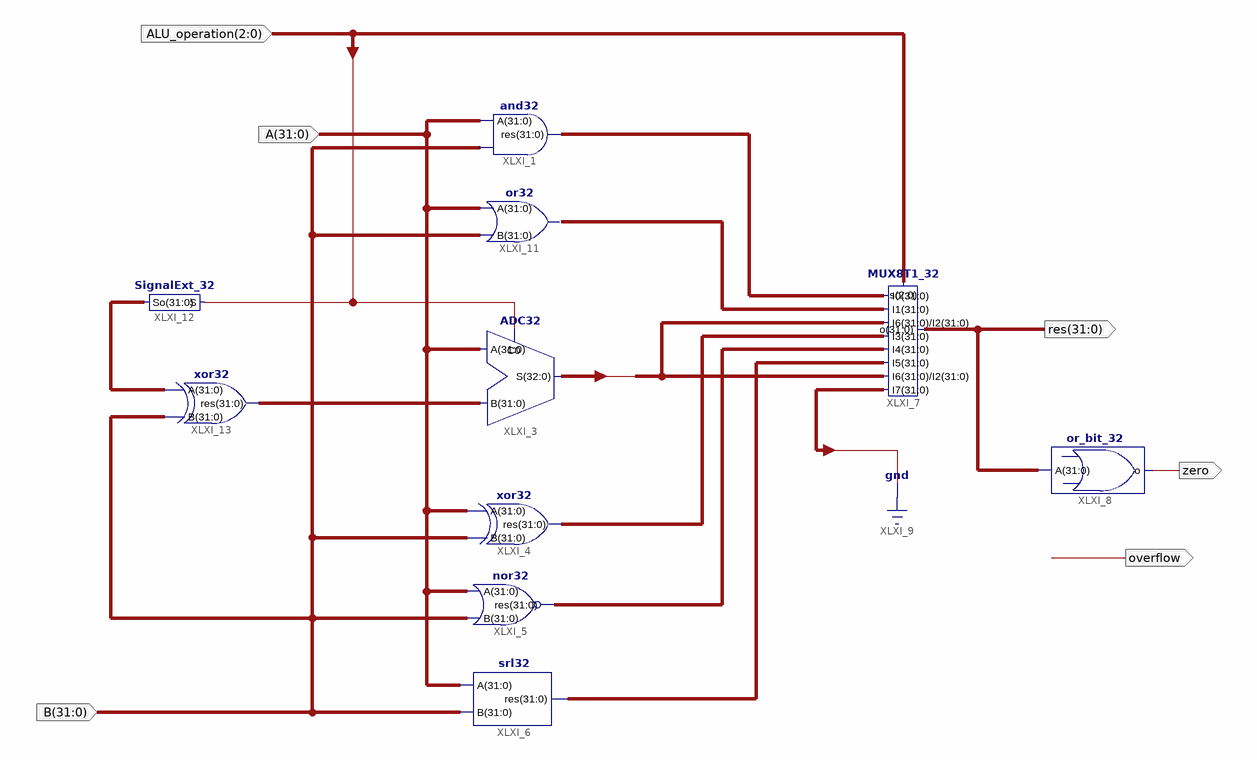
[diagram p0: schematic sheet 1]
// Xilinx ISE schematic ALU.sch (kintex7) as structural Verilog: 10 symbols, 6 ports
module ALU (
  input  [31:0] A,
  input  [2:0] ALU_operation,
  input  [31:0] B,
  output [31:0] res,
  output zero,
  output overflow
);

  wire [31:0] XLXN_1, XLXN_2, XLXN_9, XLXN_10, XLXN_11, XLXN_39, XLXN_41;
  wire [32:0] S;

  and32 XLXI_1 (.res(XLXN_1), .A(A), .B(B));
  ADC32 XLXI_3 (.B(XLXN_41), .A(A), .C0(ALU_operation[2]), .S(S));
  xor32 XLXI_4 (.A(A), .B(B), .res(XLXN_9));
  nor32 XLXI_5 (.res(XLXN_10), .A(A), .B(B));
  srl32 XLXI_6 (.A(A), .B(B), .res(XLXN_11));
  MUX8T1_32 XLXI_7 (
    .s(ALU_operation), .I7({{31{1'b0}}, S[32]}), .I6(S[31:0]), .I5(XLXN_11), .I4(XLXN_10), .I3(XLXN_9),
    .I2(S[31:0]), .I1(XLXN_2), .I0(XLXN_1), .o(res));
  or_bit_32 XLXI_8 (.o(zero), .A(res));
  or32 XLXI_11 (.res(XLXN_2), .A(A), .B(B));
  SignalExt_32 XLXI_12 (.So(XLXN_39), .S(ALU_operation[2]));
  xor32 XLXI_13 (.A(XLXN_39), .B(B), .res(XLXN_41));
endmodule
